# Altium schematic sheet Alt_BRD_PowerModules.SchDoc (part 1 of 2)
size A1; SheetNumber: 1; SheetTotal: 1
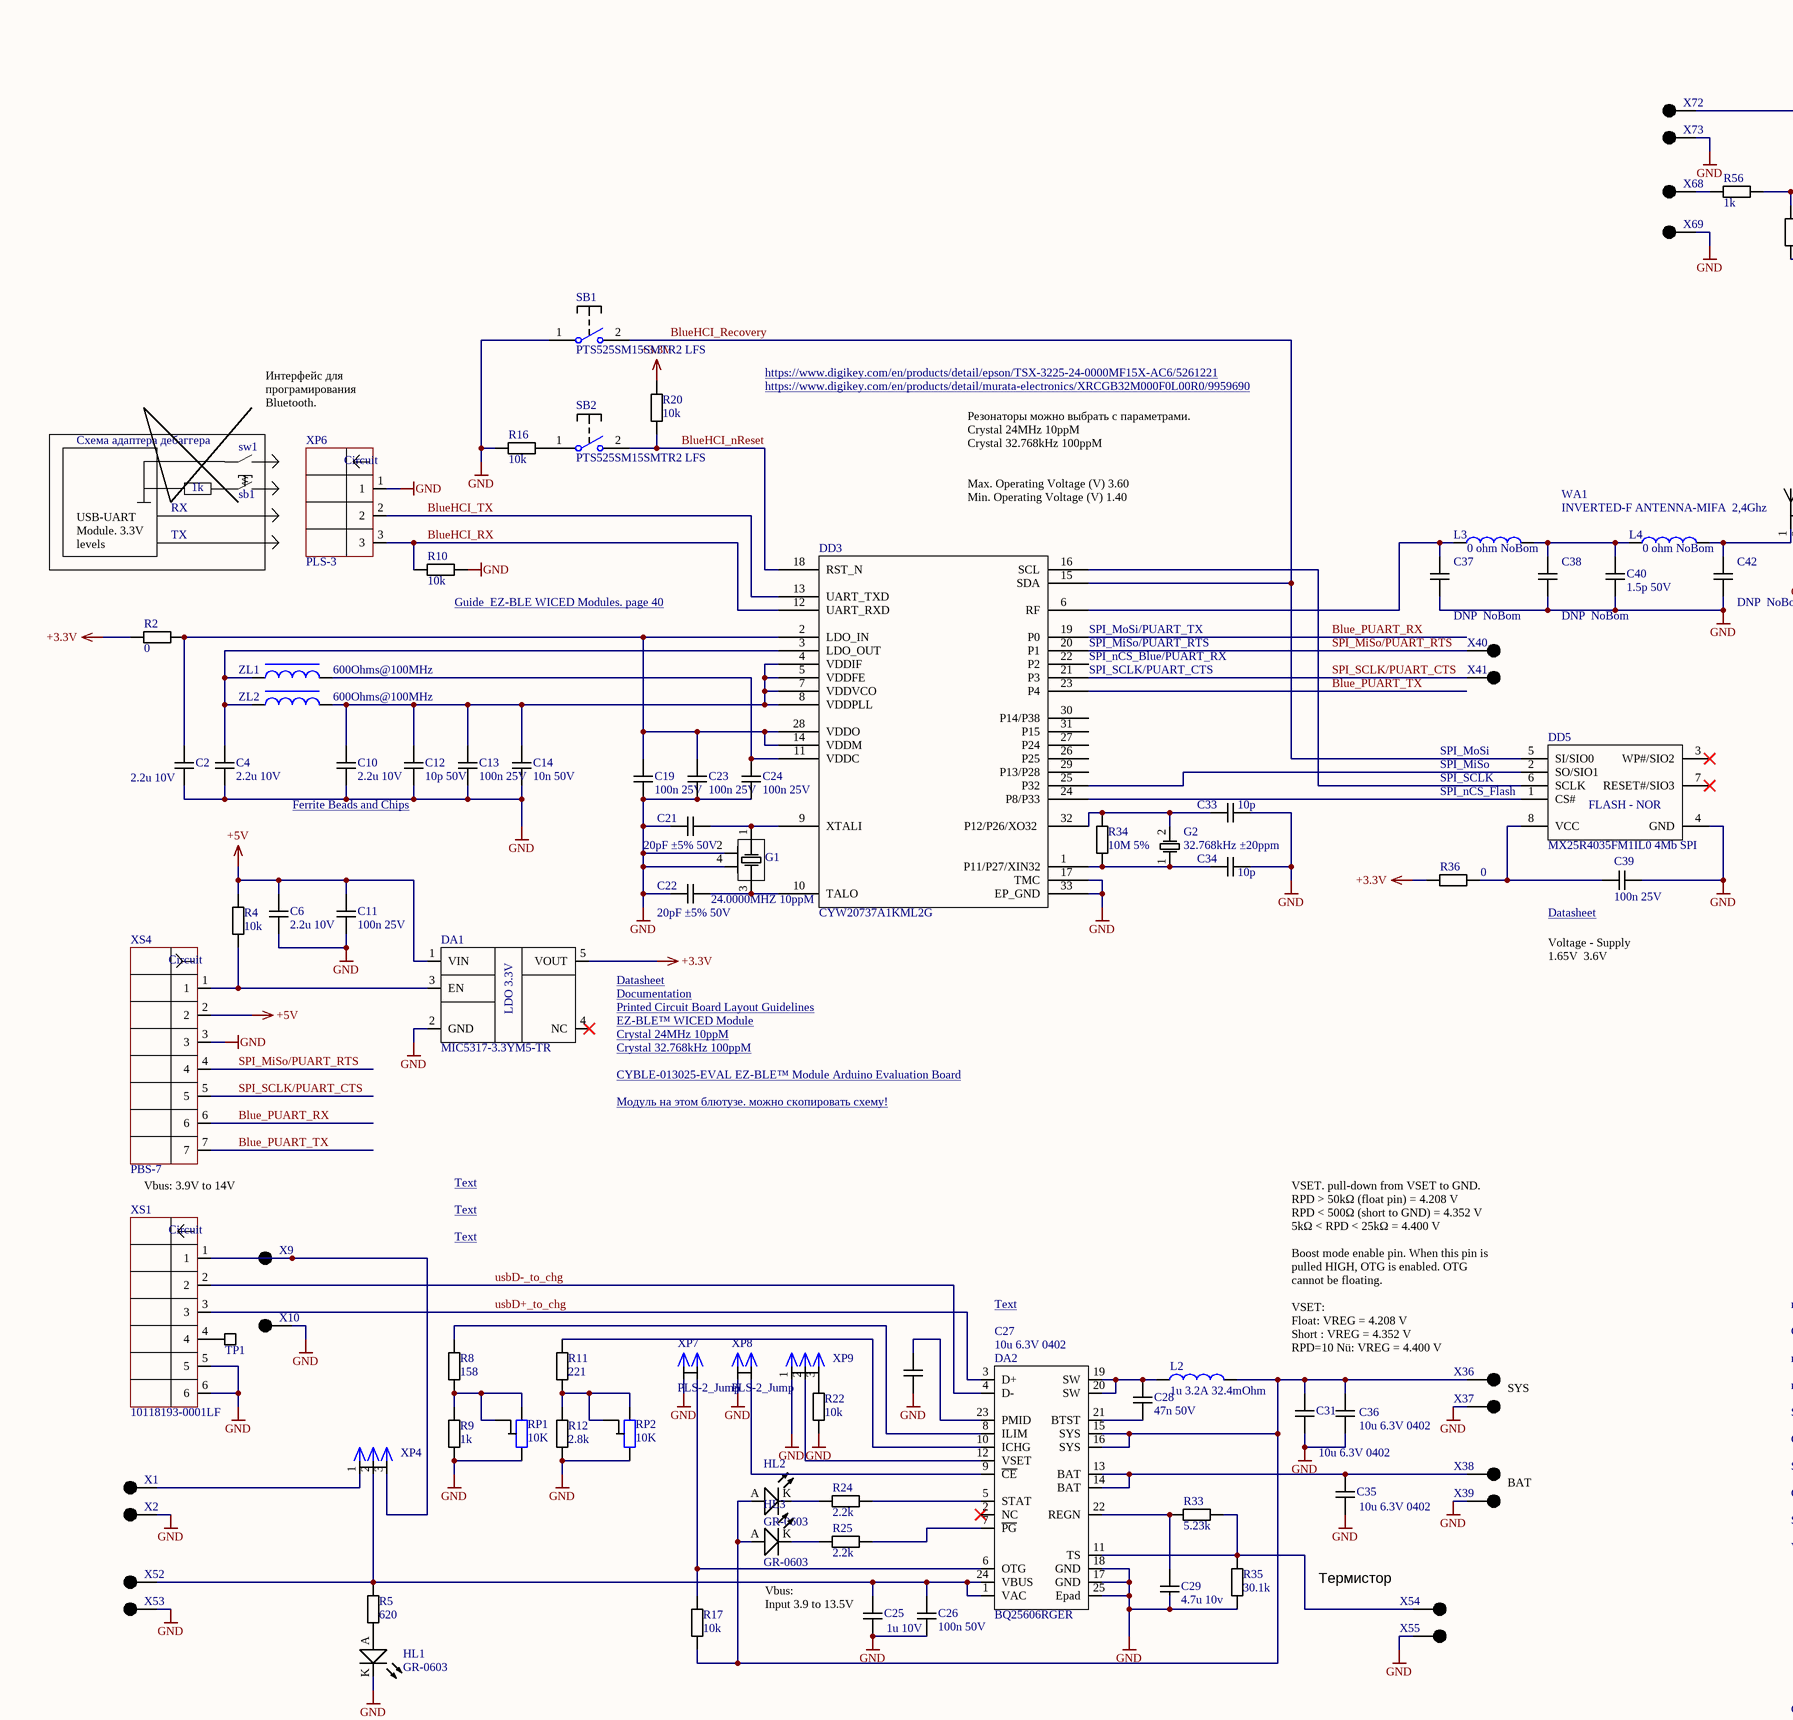
[diagram p0: Alt_BRD_PowerModules.SchDoc, top left]
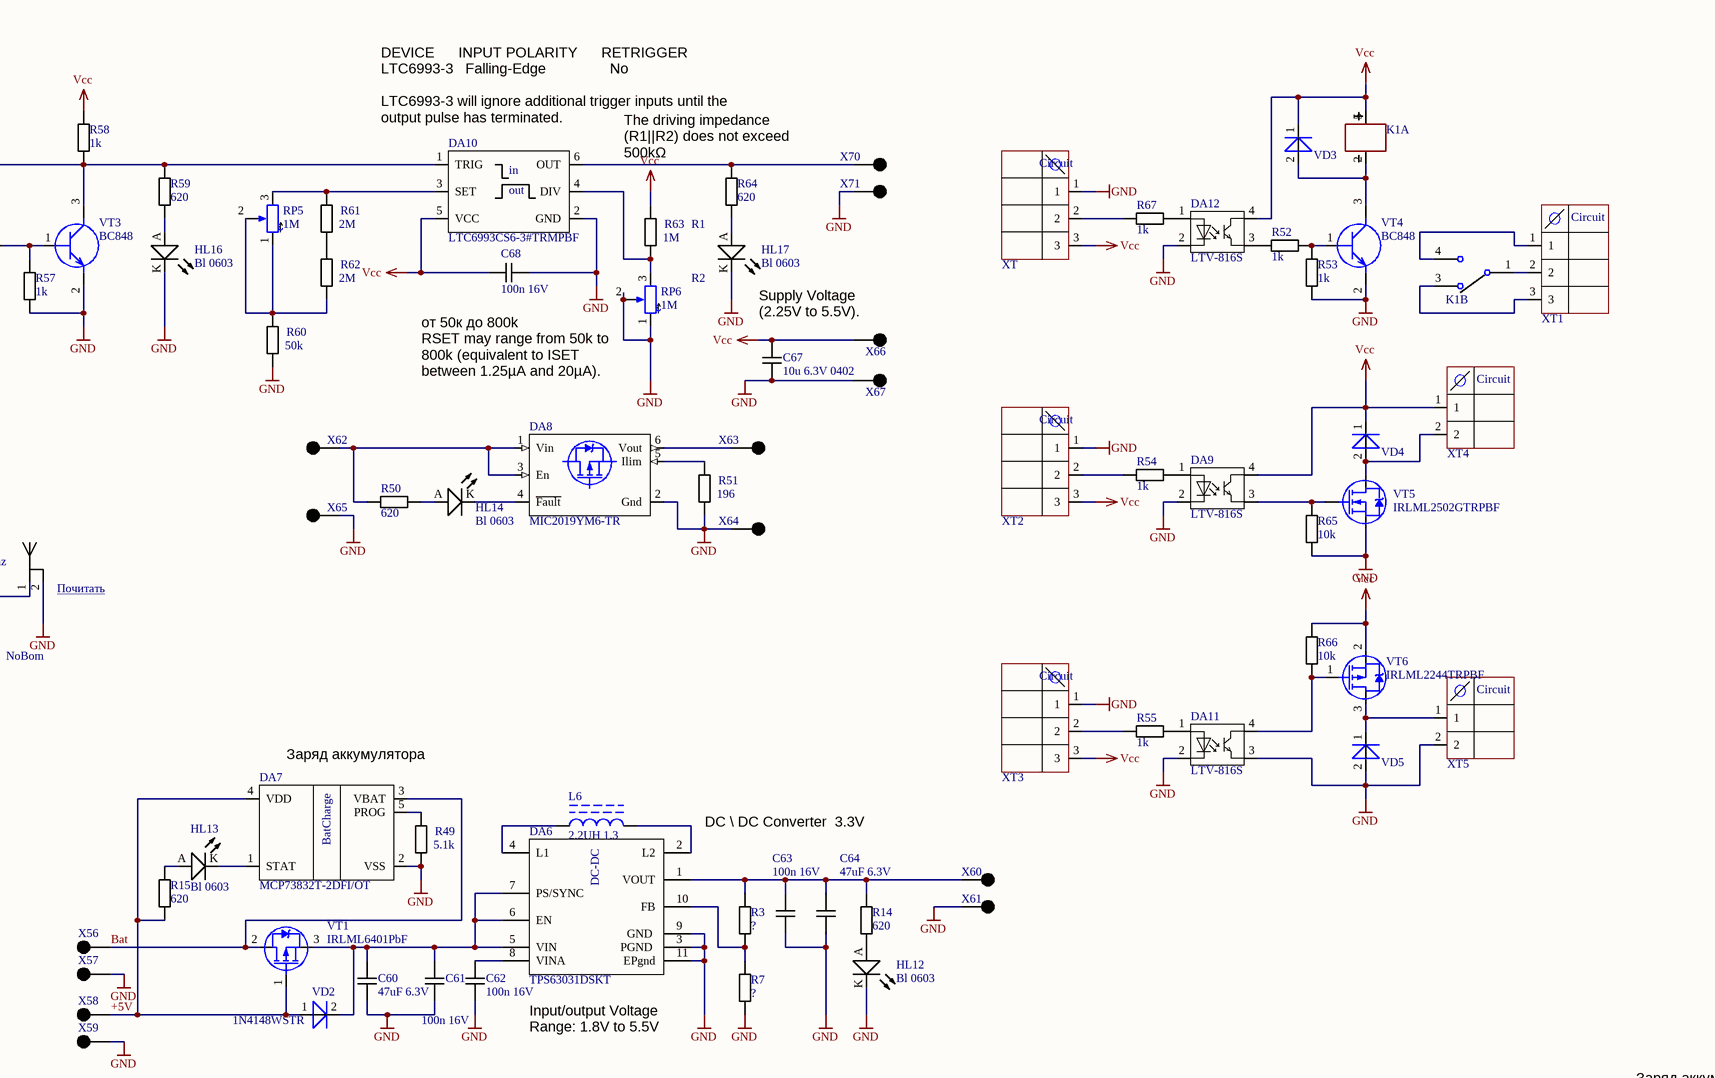
[diagram p1: Alt_BRD_PowerModules.SchDoc, top right]
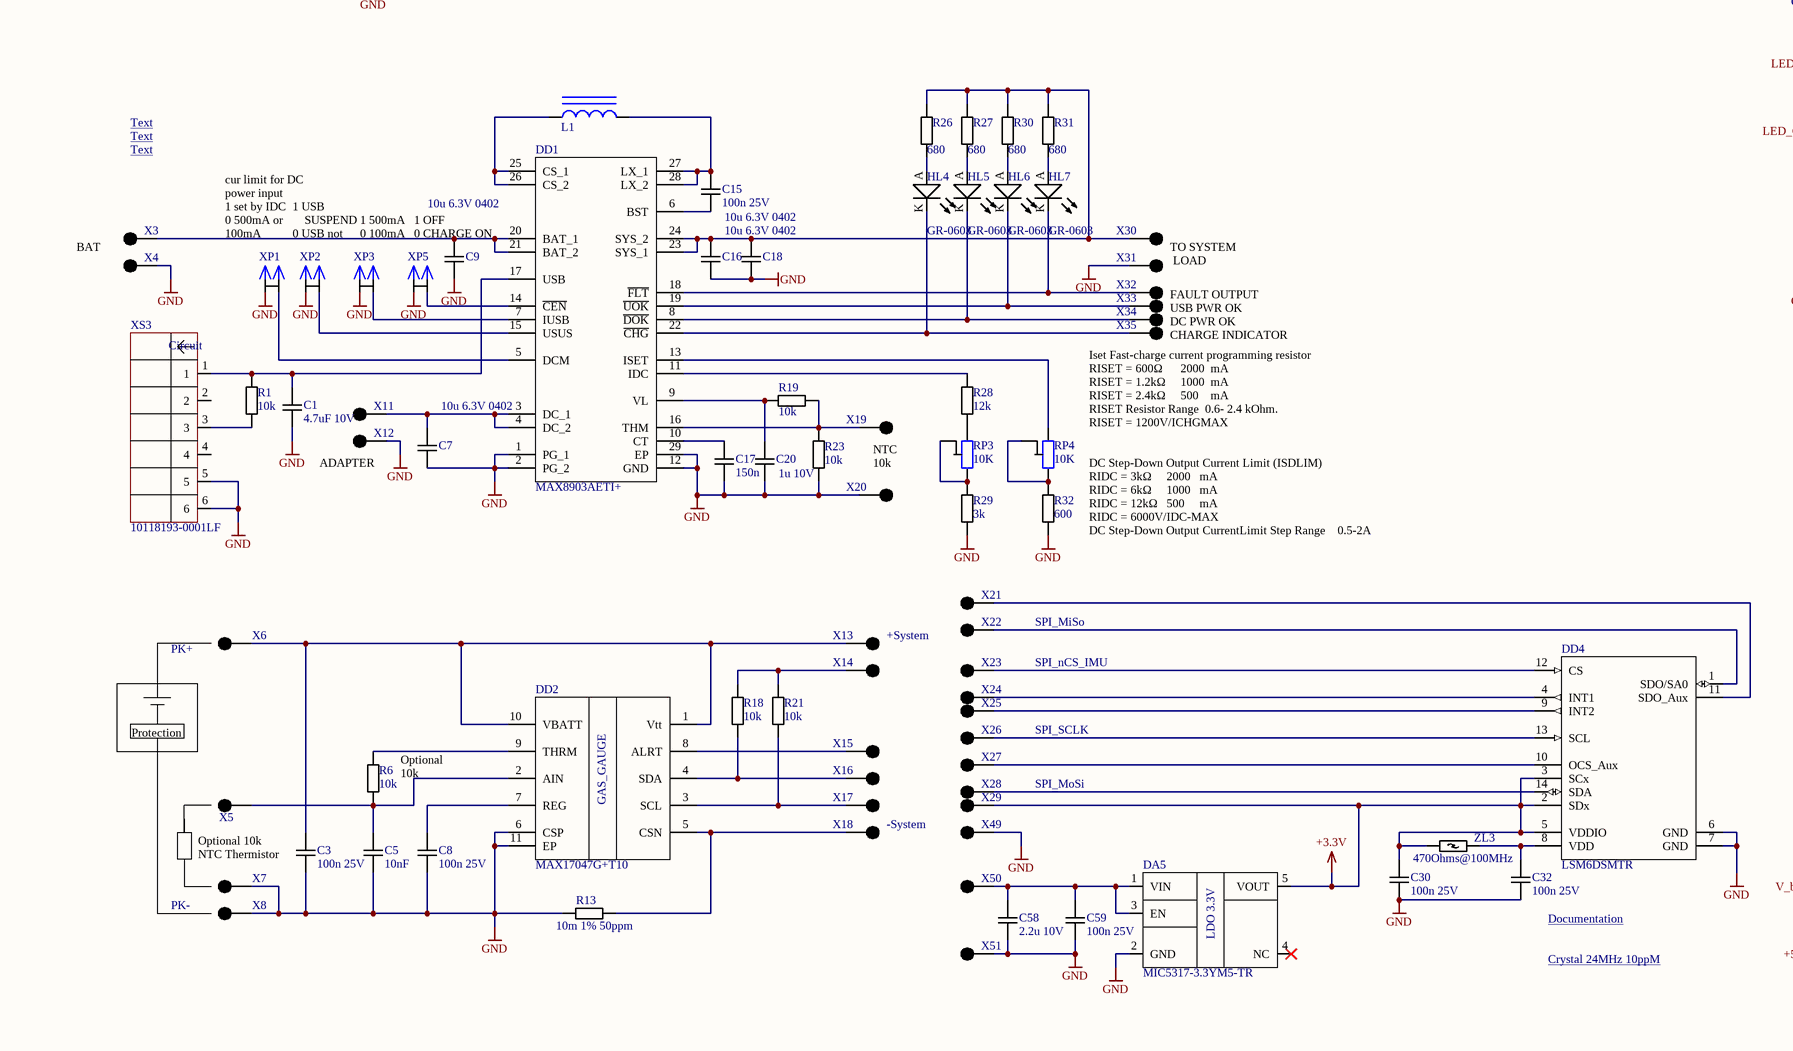
[diagram p2: Alt_BRD_PowerModules.SchDoc, bottom left]
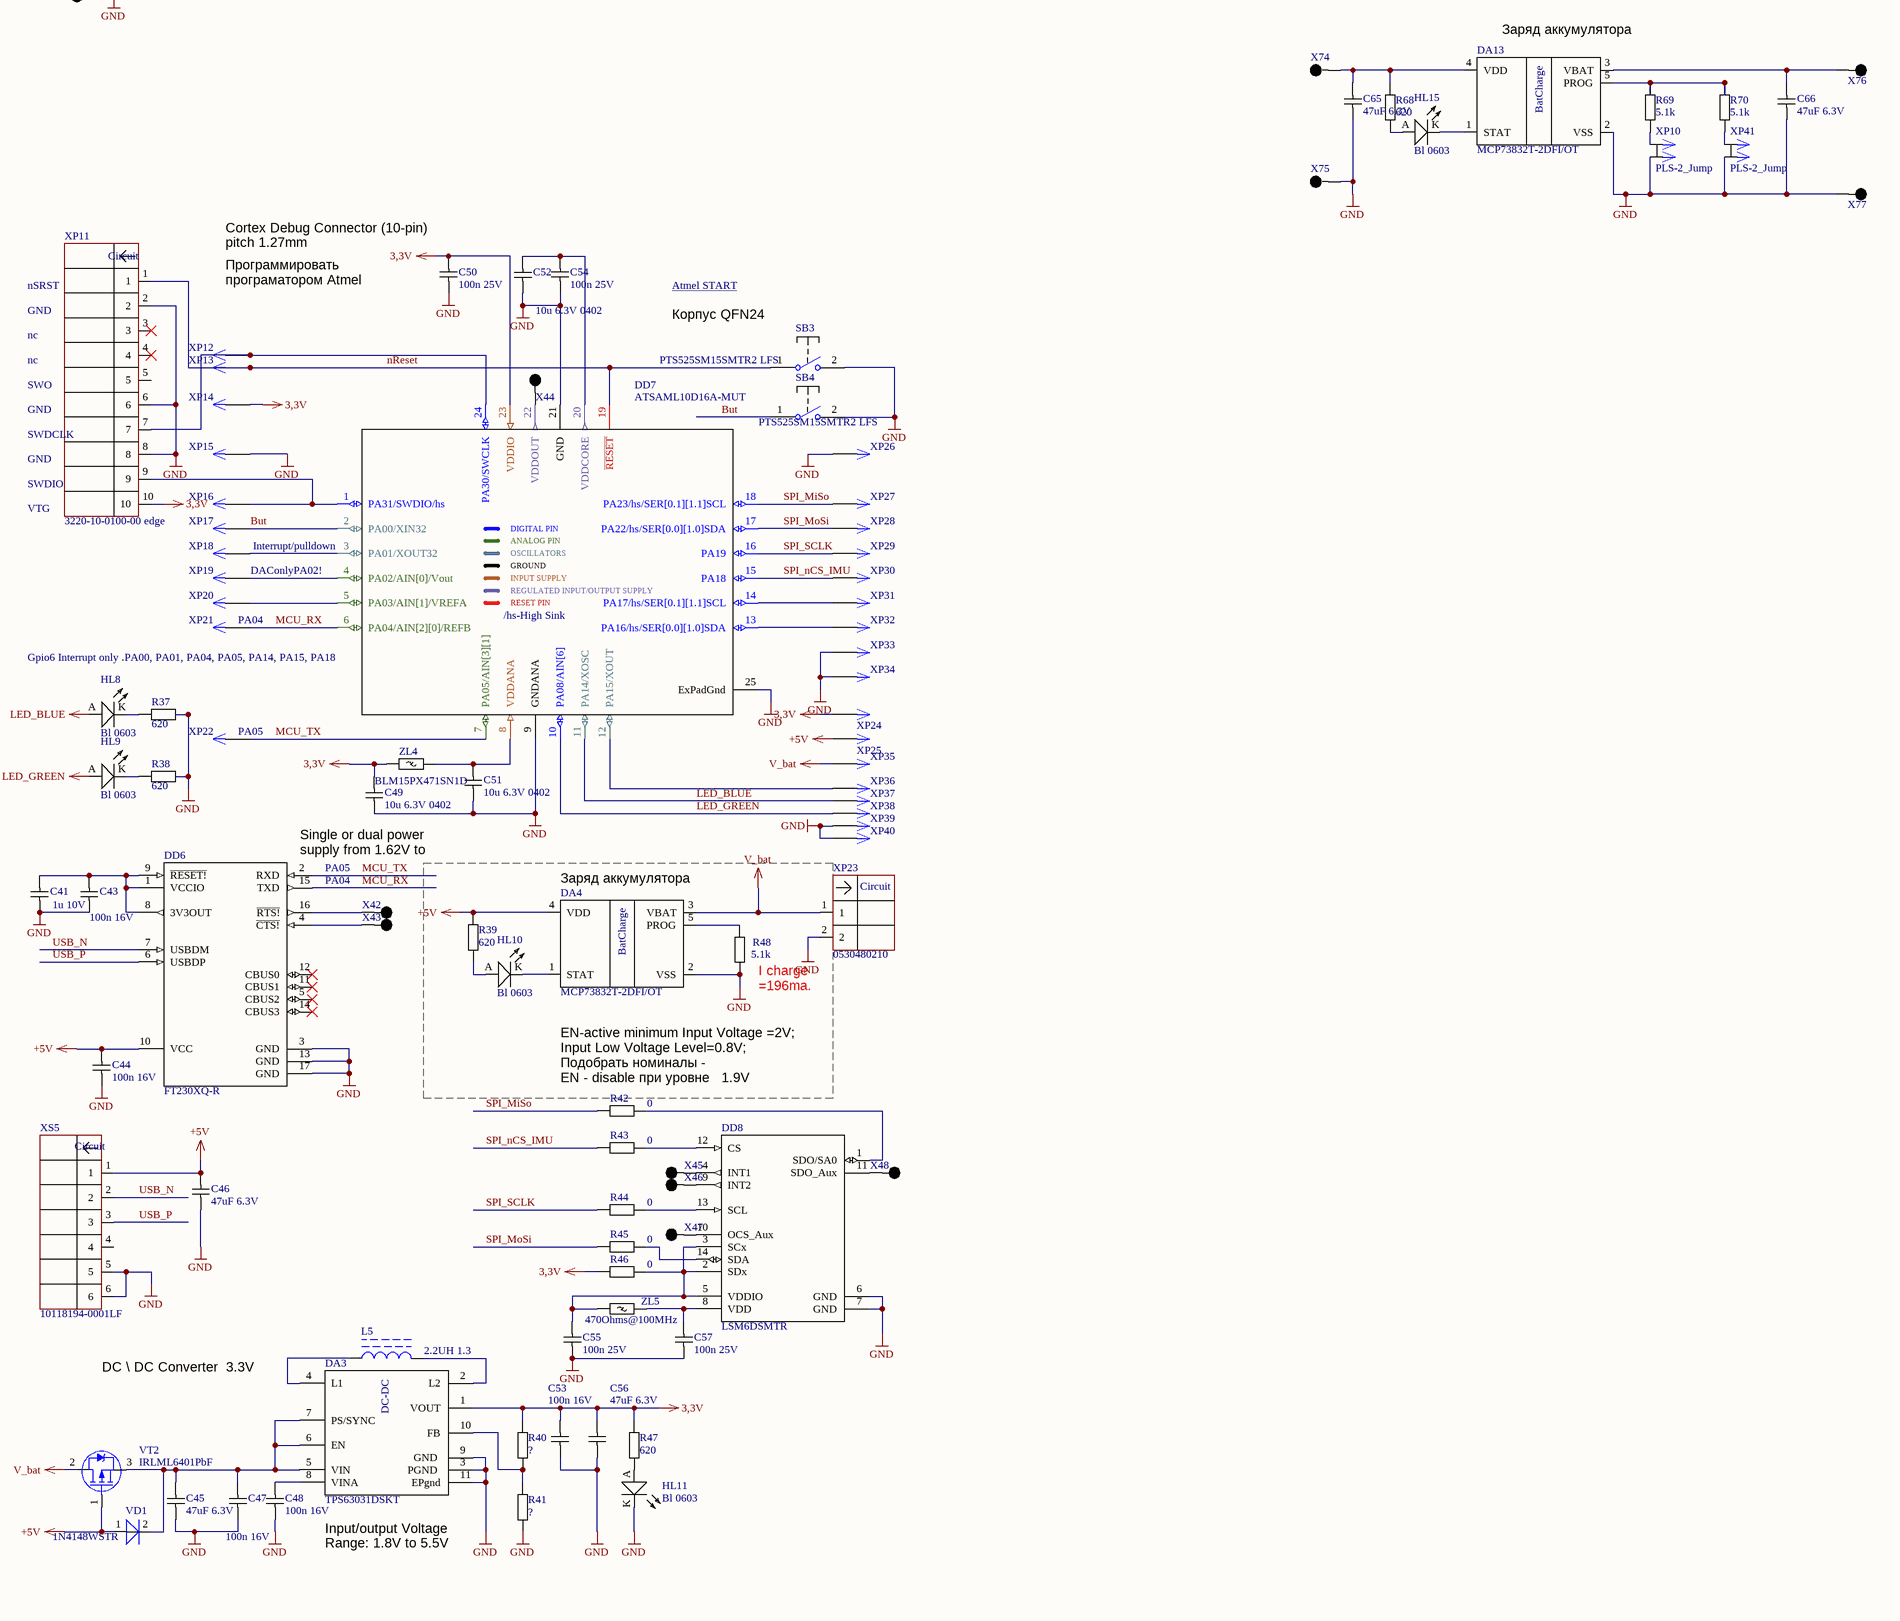
[diagram p3: Alt_BRD_PowerModules.SchDoc, bottom right]

## Parts
C1  4.7uF 10V  [CapKemet1005(0402)]
C2  2.2u 10V  [CapKemet1005(0402)]
C3  100n 25V  [CapKemet1005(0402)]
C4  2.2u 10V  [CapKemet1005(0402)]
C5  10nF  [CapKemet1005(0402)]
C6  2.2u 10V  [CapKemet1005(0402)]
C7  10u 6.3V 0402  [CapKemet1005(0402)]
C8  100n 25V  [CapKemet1005(0402)]
C9  10u 6.3V 0402  [CapKemet1005(0402)]
C10  2.2u 10V  [CapKemet1005(0402)]
C11  100n 25V  [CapKemet1005(0402)]
C12  10p 50V  [CapKemet1005(0402)]
C13  100n 25V  [CapKemet1005(0402)]
C14  10n 50V  [CapKemet1005(0402)]
C15  100n 25V  [CapKemet1005(0402)]
C16  10u 6.3V 0402  [CapKemet1005(0402)]
C17  150n  [CapKemet1005(0402)]
C18  10u 6.3V 0402  [CapKemet1005(0402)]
C19  100n 25V  [CapKemet1005(0402)]
C20  1u 10V  [CapKemet1005(0402)]
C21  20pF ±5% 50V  [CapKemet1005(0402)]
C22  20pF ±5% 50V  [CapKemet1005(0402)]
C23  100n 25V  [CapKemet1005(0402)]
C24  100n 25V  [CapKemet1005(0402)]
C25  1u 10V  [CapKemet1005(0402)]
C26  100n 50V  [CapKemet1005(0402)]
C27  10u 6.3V 0402  [CapKemet1005(0402)]
C28  47n 50V  [CapKemet1005(0402)]
C29  4.7u 10v  [CapKemet1005(0402)]
C30  100n 25V  [CapKemet1005(0402)]
C31  10u 6.3V 0402  [CapKemet1005(0402)]
C32  100n 25V  [CapKemet1005(0402)]
C33  10p  [CapKemet1005(0402)]
C34  10p  [CapKemet1005(0402)]
C35  10u 6.3V 0402  [CapKemet1005(0402)]
C36  10u 6.3V 0402  [CapKemet1005(0402)]
C37  DNP  NoBom  [CapKemet1005(0402)]  (no BOM)
C38  DNP  NoBom  [CapKemet1005(0402)]  (no BOM)
C39  100n 25V  [CapKemet1005(0402)]
C40  1.5p 50V  [CapKemet1005(0402)]
C41  1u 10V  [CapKemet1005(0402)]
C42  DNP  NoBom  [CapKemet1005(0402)]  (no BOM)
C43  100n 16V  [CapKemet1005(0402)]
C44  100n 16V  [CapKemet1005(0402)]
C45  47uF 6.3V  [CapKemet1005(0402)]
C46  47uF 6.3V  [CapKemet1005(0402)]
C47  100n 16V  [CapKemet1005(0402)]
C48  100n 16V  [CapKemet1005(0402)]
C49  10u 6.3V 0402  [CapKemet1005(0402)]
C50  100n 25V  [CapKemet1005(0402)]
C51  10u 6.3V 0402  [CapKemet1005(0402)]
C52  10u 6.3V 0402  [CapKemet1005(0402)]
C53  100n 16V  [CapKemet1005(0402)]
C54  100n 25V  [CapKemet1005(0402)]
C55  100n 25V  [CapKemet1005(0402)]
C56  47uF 6.3V  [CapKemet1005(0402)]
C57  100n 25V  [CapKemet1005(0402)]
C58  2.2u 10V  [CapKemet1005(0402)]
C59  100n 25V  [CapKemet1005(0402)]
C60  47uF 6.3V  [CapKemet1005(0402)]
C61  100n 16V  [CapKemet1005(0402)]
C62  100n 16V  [CapKemet1005(0402)]
C63  100n 16V  [CapKemet1005(0402)]
C64  47uF 6.3V  [CapKemet1005(0402)]
C65  47uF 6.3V  [CapKemet1005(0402)]
C66  47uF 6.3V  [CapKemet1005(0402)]
C67  10u 6.3V 0402  [CapKemet1005(0402)]
C68  100n 16V  [CapKemet1005(0402)]
DA1  MIC5317-3.3YM5-TR  [SOT-23-OT5_N]
DA2  BQ25606RGER  [VQFN-24]
DA3  TPS63031DSKT  [WSON-10]
DA4  MCP73832T-2DFI/OT  [SOT-23-5]
DA5  MIC5317-3.3YM5-TR  [SOT-23-OT5_N]
DA6  TPS63031DSKT  [WSON-10]
DA7  MCP73832T-2DFI/OT  [SOT-23-5]
DA8  MIC2019YM6-TR  [SOT23-6]
DA9  LTV-816S  [LTV-816S]
DA10  LTC6993CS6-3#TRMPBF  [SOT23-6]
DA11  LTV-816S  [LTV-816S]
DA12  LTV-816S  [LTV-816S]
DA13  MCP73832T-2DFI/OT  [SOT-23-5]
DD1  MAX8903AETI+  [QFN40P400X400X80-29N]
DD2  MAX17047G+T10  [DFN10(3x3)_N]
DD3  CYW20737A1KML2G  [QFN5X5-32_N]
DD4  LSM6DSMTR  [LGA-14L_2P5X3X0P83_STM-M]
DD5  MX25R4035FM1IL0 4Mb SPI  [MCHP-SOIC-SN8_M]
DD6  FT230XQ-R  [QFN-16(4x4)]
DD7  ATSAML10D16A-MUT  [VQFN-24]
DD8  LSM6DSMTR  [LGA-14L_2P5X3X0P83_STM-M]
G1  24.0000MHZ 10ppM  [TSX-3225]
G2  32.768kHz ±20ppm  [VMK3-9005]
HL1  GR-0603  [LED-0603-GREEN]
HL2  GR-0603  [LED-0603-GREEN]
HL3  GR-0603  [LED-0603-GREEN]
HL4  GR-0603  [LED-0603-GREEN]
HL5  GR-0603  [LED-0603-GREEN]
HL6  GR-0603  [LED-0603-GREEN]
HL7  GR-0603  [LED-0603-GREEN]
HL8  Bl 0603  [LED-0603-BLUE]
HL9  Bl 0603  [LED-0603-BLUE]
HL10  Bl 0603  [LED-0603-BLUE]
HL11  Bl 0603  [LED-0603-BLUE]
HL12  Bl 0603  [LED-0603-BLUE]
HL13  Bl 0603  [LED-0603-BLUE]
HL14  Bl 0603  [LED-0603-BLUE]
HL15  Bl 0603  [LED-0603-BLUE]
HL16  Bl 0603  [LED-0603-BLUE]
HL17  Bl 0603  [LED-0603-BLUE]
K1  5V 3A 250VAC  [SRS-05VDC-SL]  (value not drawn)  (parts A,B of 2)
L1  2.5UH 5A 27 MOHM  [SDE0805A]  (value not drawn)
L2  1u 3.2A 32.4mOhm  [NRS4018]
L3  0 ohm NoBom  [INDC1608(0603)N]  (no BOM)
L4  0 ohm NoBom  [INDC1608(0603)N]  (no BOM)
L5  2.2UH 1.3  [CDRH2D11]
L6  2.2UH 1.3  [CDRH2D11]
R1  10k  [REZKemet 0402]
R2  0  [REZKemet 0402]
R3  ?  [REZKemet 0402]
R4  10k  [REZKemet 0402]
R5  620  [REZKemet 0402]
R6  10k  [REZKemet 0402]
R7  ?  [REZKemet 0402]
R8  158  [REZKemet 0402]
R9  1k  [REZKemet 0402]
R10  10k  [REZKemet 0402]
R11  221  [REZKemet 0402]
R12  2.8k  [REZKemet 0402]
R13  10m 1% 50ppm  [RESC2012(0805)N]
R14  620  [REZKemet 0402]
R15  620  [REZKemet 0402]
R16  10k  [REZKemet 0402]
R17  10k  [REZKemet 0402]
R18  10k  [REZKemet 0402]
R19  10k  [REZKemet 0402]
R20  10k  [REZKemet 0402]
R21  10k  [REZKemet 0402]
R22  10k  [REZKemet 0402]
R23  10k  [REZKemet 0402]
R24  2.2k  [REZKemet 0402]
R25  2.2k  [REZKemet 0402]
R26  680  [REZKemet 0402]
R27  680  [REZKemet 0402]
R28  12k  [REZKemet 0402]
R29  3k  [REZKemet 0402]
R30  680  [REZKemet 0402]
R31  680  [REZKemet 0402]
R32  600  [REZKemet 0402]
R33  5.23k  [REZKemet 0402]
R34  10M 5%  [REZKemet 0402]
R35  30.1k  [REZKemet 0402]
R36  0  [REZKemet 0402]
R37  620  [REZKemet 0402]
R38  620  [REZKemet 0402]
R39  620  [REZKemet 0402]
R40  ?  [REZKemet 0402]
R41  ?  [REZKemet 0402]
R42  0  [REZKemet 0402]
R43  0  [REZKemet 0402]
R44  0  [REZKemet 0402]
R45  0  [REZKemet 0402]
R46  0  [REZKemet 0402]
R47  620  [REZKemet 0402]
R48  5.1k  [REZKemet 0402]
R49  5.1k  [REZKemet 0402]
R50  620  [REZKemet 0402]
R51  196  [REZKemet 0402]
R52  1k  [RESC1608(0603)N]
R53  1k  [RESC1608(0603)N]
R54  1k  [RESC1608(0603)N]
R55  1k  [RESC1608(0603)N]
R56  1k  [REZKemet 0402]
R57  1k  [REZKemet 0402]
R58  1k  [REZKemet 0402]
R59  620  [REZKemet 0402]
R60  50k  [REZKemet 0402]
R61  2M  [REZKemet 0402]
R62  2M  [REZKemet 0402]
R63  1M  [REZKemet 0402]
R64  620  [REZKemet 0402]
R65  10k  [RESC1608(0603)N]
R66  10k  [RESC1608(0603)N]
R67  1k  [RESC1608(0603)N]
R68  620  [REZKemet 0402]
R69  5.1k  [REZKemet 0402]
R70  5.1k  [REZKemet 0402]
RP1  10K  [3296W_1]
RP2  10K  [3296W_1]
RP3  10K  [3296W_1]
RP4  10K  [3296W_1]
RP5  1M  [3296W]
RP6  1M  [3296W]
SB1  PTS525SM15SMTR2 LFS  [TACT_SWITCH KPT1187B]
SB2  PTS525SM15SMTR2 LFS  [TACT_SWITCH KPT1187B]
SB3  PTS525SM15SMTR2 LFS  [TACT_SWITCH KPT1187B]
SB4  PTS525SM15SMTR2 LFS  [TACT_SWITCH KPT1187B]
TP1  TP(No BOM)  [PLLS1.27-1-R]  (value not drawn)  (no BOM)
VD1  1N4148WSTR  [SOD323]
VD2  1N4148WSTR  [SOD323]
VD3  BAT54J  [SOD323]  (value not drawn)
VD4  BAT54J  [SOD323]  (value not drawn)
VD5  BAT54J  [SOD323]  (value not drawn)
VT1  IRLML6401PbF  [SOT23-3N]
VT2  IRLML6401PbF  [SOT23-3N]
VT3  BC848  [SOT23-3N]
VT4  BC848  [SOT23-3N]
VT5  IRLML2502GTRPBF  [SOT23-3N]
VT6  IRLML2244TRPBF  [SOT23-3N]
WA1  INVERTED-F ANTENNA-MIFA  2,4Ghz  [INVERTED-F ANTENNA-MIFA]  (net tie, no BOM)
X1  X1-PLS-1  [HoleSolderPLS-1]  (value not drawn)
X2  X1-PLS-1  [HoleSolderPLS-1]  (value not drawn)
X3  X1-PLS-1  [HoleSolderPLS-1]  (value not drawn)
X4  X1-PLS-1  [HoleSolderPLS-1]  (value not drawn)
X5  X1-PLS-1  [HoleSolderPLS-1]  (value not drawn)
X6  X1-PLS-1  [HoleSolderPLS-1]  (value not drawn)
X7  X1-PLS-1  [HoleSolderPLS-1]  (value not drawn)
X8  X1-PLS-1  [HoleSolderPLS-1]  (value not drawn)
X9  X1-PLS-1  [HoleSolderPLS-1]  (value not drawn)
X10  X1-PLS-1  [HoleSolderPLS-1]  (value not drawn)
X11  X1-PLS-1  [HoleSolderPLS-1]  (value not drawn)
X12  X1-PLS-1  [HoleSolderPLS-1]  (value not drawn)
X13  X1-PLS-1  [HoleSolderPLS-1]  (value not drawn)
X14  X1-PLS-1  [HoleSolderPLS-1]  (value not drawn)
X15  X1-PLS-1  [HoleSolderPLS-1]  (value not drawn)
X16  X1-PLS-1  [HoleSolderPLS-1]  (value not drawn)
X17  X1-PLS-1  [HoleSolderPLS-1]  (value not drawn)
X18  X1-PLS-1  [HoleSolderPLS-1]  (value not drawn)
X19  X1-PLS-1  [HoleSolderPLS-1]  (value not drawn)
X20  X1-PLS-1  [HoleSolderPLS-1]  (value not drawn)
X21  PLLS1.27-1-R  [PLLS1.27-1-R]  (value not drawn)
X22  PLLS1.27-1-R  [PLLS1.27-1-R]  (value not drawn)
X23  PLLS1.27-1-R  [PLLS1.27-1-R]  (value not drawn)
X24  PLLS1.27-1-R  [PLLS1.27-1-R]  (value not drawn)
X25  PLLS1.27-1-R  [PLLS1.27-1-R]  (value not drawn)
X26  PLLS1.27-1-R  [PLLS1.27-1-R]  (value not drawn)
X27  PLLS1.27-1-R  [PLLS1.27-1-R]  (value not drawn)
X28  PLLS1.27-1-R  [PLLS1.27-1-R]  (value not drawn)
X29  PLLS1.27-1-R  [PLLS1.27-1-R]  (value not drawn)
X30  X1-PLS-1  [HoleSolderPLS-1]  (value not drawn)
X31  X1-PLS-1  [HoleSolderPLS-1]  (value not drawn)
X32  X1-PLS-1  [HoleSolderPLS-1]  (value not drawn)
X33  X1-PLS-1  [HoleSolderPLS-1]  (value not drawn)
X34  X1-PLS-1  [HoleSolderPLS-1]  (value not drawn)
X35  X1-PLS-1  [HoleSolderPLS-1]  (value not drawn)
X36  X1-PLS-1  [HoleSolderPLS-1]  (value not drawn)
X37  X1-PLS-1  [HoleSolderPLS-1]  (value not drawn)
X38  X1-PLS-1  [HoleSolderPLS-1]  (value not drawn)
X39  X1-PLS-1  [HoleSolderPLS-1]  (value not drawn)
X40  PLLS1.27-1-TOP-R  [PLLS1.27-1-TOP-R]  (value not drawn)
X41  PLLS1.27-1-TOP-R  [PLLS1.27-1-TOP-R]  (value not drawn)
X42  PLLS1.27-1-TOP-R  [PLLS1.27-1-TOP-R]  (value not drawn)
X43  PLLS1.27-1-TOP-R  [PLLS1.27-1-TOP-R]  (value not drawn)
X44  PLLS1.27-1-TOP-R  [PLLS1.27-1-TOP-R]  (value not drawn)
X45  PLLS1.27-1-TOP-R  [PLLS1.27-1-TOP-R]  (value not drawn)
X46  PLLS1.27-1-TOP-R  [PLLS1.27-1-TOP-R]  (value not drawn)
X47  PLLS1.27-1-TOP-R  [PLLS1.27-1-TOP-R]  (value not drawn)
X48  PLLS1.27-1-TOP-R  [PLLS1.27-1-TOP-R]  (value not drawn)
X49  PLLS1.27-1-R  [PLLS1.27-1-R]  (value not drawn)
X50  PLLS1.27-1-R  [PLLS1.27-1-R]  (value not drawn)
X51  PLLS1.27-1-R  [PLLS1.27-1-R]  (value not drawn)
X52  X1-PLS-1  [HoleSolderPLS-1]  (value not drawn)
X53  X1-PLS-1  [HoleSolderPLS-1]  (value not drawn)
X54  X1-PLS-1  [HoleSolderPLS-1]  (value not drawn)
X55  X1-PLS-1  [HoleSolderPLS-1]  (value not drawn)
X56  PLLS1.27-1-R  [PLLS1.27-1-R]  (value not drawn)
X57  PLLS1.27-1-R  [PLLS1.27-1-R]  (value not drawn)
X58  PLLS1.27-1-R  [PLLS1.27-1-R]  (value not drawn)
X59  PLLS1.27-1-R  [PLLS1.27-1-R]  (value not drawn)
X60  PLLS1.27-1-R  [PLLS1.27-1-R]  (value not drawn)
X61  PLLS1.27-1-R  [PLLS1.27-1-R]  (value not drawn)
X62  X1-PLS-1  [HoleSolderPLS-1]  (value not drawn)
X63  X1-PLS-1  [HoleSolderPLS-1]  (value not drawn)
X64  X1-PLS-1  [HoleSolderPLS-1]  (value not drawn)
X65  X1-PLS-1  [HoleSolderPLS-1]  (value not drawn)
X66  X1-PLS-1  [HoleSolderPLS-1]  (value not drawn)
X67  X1-PLS-1  [HoleSolderPLS-1]  (value not drawn)
X68  X1-PLS-1  [HoleSolderPLS-1]  (value not drawn)
X69  X1-PLS-1  [HoleSolderPLS-1]  (value not drawn)
X70  X1-PLS-1  [HoleSolderPLS-1]  (value not drawn)
X71  X1-PLS-1  [HoleSolderPLS-1]  (value not drawn)
X72  X1-PLS-1  [HoleSolderPLS-1]  (value not drawn)
X73  X1-PLS-1  [HoleSolderPLS-1]  (value not drawn)
X74  PLLS1.27-1-R  [PLLS1.27-1-R]  (value not drawn)
X75  PLLS1.27-1-R  [PLLS1.27-1-R]  (value not drawn)
X76  PLLS1.27-1-R  [PLLS1.27-1-R]  (value not drawn)
X77  PLLS1.27-1-R  [PLLS1.27-1-R]  (value not drawn)
XP1  PLS-2_Jump  [PLS-2-3D]  (value not drawn)
XP2  PLS-2_Jump  [PLS-2-3D]  (value not drawn)
XP3  PLS-2_Jump  [PLS-2-3D]  (value not drawn)
XP4  PLS-3  [PLS-3-3D]  (value not drawn)
XP5  PLS-2_Jump  [PLS-2-3D]  (value not drawn)
XP6  PLS-3  [PLS-3-3D]
XP7  PLS-2_Jump  [PLS-2-3D]
XP8  PLS-2_Jump  [PLS-2-3D]
XP9  PLS-3  [PLS-3-3D]  (value not drawn)
XP10  PLS-2_Jump  [PLS-2-3D]
XP11  3220-10-0100-00 edge  [IPS 10(1.27)edge]
XP12  PLS-1  [PLS-1-3D]  (value not drawn)
XP13  PLS-1  [PLS-1-3D]  (value not drawn)
XP14  PLS-1  [PLS-1-3D]  (value not drawn)
XP15  PLS-1  [PLS-1-3D]  (value not drawn)
XP16  PLS-1  [PLS-1-3D]  (value not drawn)
XP17  PLS-1  [PLS-1-3D]  (value not drawn)
XP18  PLS-1  [PLS-1-3D]  (value not drawn)
XP19  PLS-1  [PLS-1-3D]  (value not drawn)
XP20  PLS-1  [PLS-1-3D]  (value not drawn)
XP21  PLS-1  [PLS-1-3D]  (value not drawn)
XP22  PLS-1  [PLS-1-3D]  (value not drawn)
XP23  0530480210  [0530480210]
XP24  PLS-1  [PLS-1-3D]  (value not drawn)
XP25  PLS-1  [PLS-1-3D]  (value not drawn)
XP26  PLS-1  [PLS-1-3D]  (value not drawn)
XP27  PLS-1  [PLS-1-3D]  (value not drawn)
XP28  PLS-1  [PLS-1-3D]  (value not drawn)
XP29  PLS-1  [PLS-1-3D]  (value not drawn)
XP30  PLS-1  [PLS-1-3D]  (value not drawn)
XP31  PLS-1  [PLS-1-3D]  (value not drawn)
XP32  PLS-1  [PLS-1-3D]  (value not drawn)
XP33  PLS-1  [PLS-1-3D]  (value not drawn)
XP34  PLS-1  [PLS-1-3D]  (value not drawn)
XP35  PLS-1  [PLS-1-3D]  (value not drawn)
XP36  PLS-1  [PLS-1-3D]  (value not drawn)
XP37  PLS-1  [PLS-1-3D]  (value not drawn)
XP38  PLS-1  [PLS-1-3D]  (value not drawn)
XP39  PLS-1  [PLS-1-3D]  (value not drawn)
XP40  PLS-1  [PLS-1-3D]  (value not drawn)
XP41  PLS-2_Jump  [PLS-2-3D]
XS1  10118193-0001LF  [10118193-0001LF]
XS3  10118193-0001LF  [10118193-0001LF]
XS4  PBS-7  [PBS-7-3D]
XS5  10118194-0001LF  [MICRO_USB _B]
XT  3pin 3,5mm  [1984620]  (value not drawn)
XT1  3pin 3,5mm  [1984620]  (value not drawn)
XT2  3pin 3,5mm  [1984620]  (value not drawn)
XT3  3pin 3,5mm  [1984620]  (value not drawn)
XT4  2pos5mm  [691137710002]  (value not drawn)
XT5  2pos5mm  [691137710002]  (value not drawn)
ZL1  600Ohms@100MHz  [Ferrite1005(0402)]
ZL2  600Ohms@100MHz  [Ferrite1005(0402)]
ZL3  470Ohms@100MHz  [Ferrite1005(0402)]
ZL4  BLM15PX471SN1D  [Ferrite1005(0402)]
ZL5  470Ohms@100MHz  [Ferrite1005(0402)]

## Nets
3,3V: C49.2 C50.1 C53.2 C56.2 DA3.1(VOUT) DD7.23(VDDIO) R40.2 R46.1 R47.2 XP11.10 XP14.1 XP24.1 ZL4.1
+3.3V: C30.1 DA1.5(VOUT) DA5.5(VOUT) DD4.2(SDx) DD4.3(SCx) DD4.5(VDDIO) R2.2 R20.2 R36.1 X29.1 ZL3.1
+5V: C6.2 C11.2 C44.2 C46.2 DA1.1(VIN) DA4.4(VDD) DA7.4(VDD) DD6.10(VCC) R4.2 R15.2 R39.2 VD1.1 VD2.1 VT1.1(G) VT2.1(G) X58.1 XP25.1 XS4.2 XS5.1
GND: C1.1 C2.1 C3.1 C4.1 C5.1 C6.1 C7.1 C8.1 C9.1 C10.1 C11.1 C12.1 C13.1 C14.1 C16.1 C17.1 C18.1 C19.1 C20.1 C21.1 C22.1 C23.1 C24.1 C25.1 C26.2 C27.1 C29.1 C30.2 C31.1 C32.2 C33.1 C34.1 C35.1 C36.1 C37.1 C38.1 C39.1 C40.1 C41.1 C42.1 C43.1 C44.1 C45.1 C46.1 C47.1 C48.1 C49.1 C50.2 C51.1 C52.1 C53.1 C54.2 C55.2 C56.1 C57.2 C58.1 C59.1 C60.1 C61.1 C62.1 C63.1 C64.1 C65.1 C66.1 C67.1 C68.1 DA1.2(GND) DA2.17(GND) DA2.18(GND) DA2.25(Epad) DA3.3(PGND) DA3.9(GND) DA3.11(EPgnd) DA4.2(VSS) DA5.2(GND) DA6.3(PGND) DA6.9(GND) DA6.11(EPgnd) DA7.2(VSS) DA8.2(Gnd) DA9.2 DA10.2(GND) DA11.2 DA11.3 DA12.2 DA13.2(VSS) DD1.1(PG_1) DD1.2(PG_2) DD1.12(GND) DD1.29(EP) DD2.6(CSP) DD2.11(EP) DD3.17(TMC) DD3.33(EP_GND) DD4.6(GND) DD4.7(GND) DD5.4(GND) DD6.3(GND) DD6.13(GND) DD6.17(GND) DD7.9(GNDANA) DD7.21(GND) DD7.25(ExPadGnd) DD8.6(GND) DD8.7(GND) G1.2 G1.4 HL1.K HL11.K HL12.K HL16.K HL17.K R7.1 R9.1 R10.1 R12.1 R13.1 R16.2 R22.2 R23.2 R29.1 R32.1 R35.2 R37.2 R38.2 R41.1 R48.2 R49.2 R51.2 R53.1 R57.2 R60.2 R65.1 RP1.3(TAP) RP2.3(TAP) RP6.1(TOP) RP6.2(BOT) SB1.1(COMMON) SB3.2(NO) SB4.2(NO) VD5.2(A) VT3.2(E) VT4.2(E) VT5.2(S) WA1.2 X2.1 X4.1 X7.1 X8.1 X10.1 X12.1 X20.1 X31.1 X37.1 X39.1 X49.1 X51.1 X53.1 X55.1 X57.1 X59.1 X61.1 X64.1 X65.1 X67.1 X69.1 X71.1 X73.1 X75.1 X77.1 XP1.1 XP2.1 XP3.1 XP5.1 XP6.1 XP7.1 XP8.1 XP9.1 XP10.2 XP11.2 XP11.6 XP11.8 XP15.1 XP23.2 XP26.1 XP33.1 XP34.1 XP39.1 XP40.1 XP41.2 XS1.5 XS1.6 XS3.5 XS3.6 XS4.3 XS5.5 XS5.6 XT.1 XT2.1 XT3.1 XT5.2
LED_BLUE: DD7.11(PA14/XOSC) HL8.A XP37.1
LED_GREEN: DD7.10(PA08/AIN[6]) HL9.A XP38.1
V_bat: DA4.3(VBAT) VT2.2(D) XP23.1 XP35.1
Vcc: C67.2 C68.2 DA9.4 DA10.5(VCC) DA12.4 K1.5 R58.1 R63.1 R66.2 VD3.1(C) VD4.1(C) VT6.2(S) X66.1 XT.3 XT2.3 XT3.3 XT4.1
Bat: DA7.3(VBAT) VT1.2(D) X56.1
Blue_PUART_RX: DD3.19(P0) XS4.6
Blue_PUART_TX: DD3.23(P4) XS4.7
BlueHCI_nReset: DD3.18(RST_N) R20.1 SB2.2(NO)
BlueHCI_Recovery: DD3.15(SDA) DD5.5(SI/SIO0) SB1.2(NO)
BlueHCI_RX: DD3.12(UART_RXD) R10.2 XP6.3
BlueHCI_TX: DD3.13(UART_TXD) XP6.2
But: DD7.2(PA00/XIN32) SB4.1(COMMON) XP17.1
MCU_RX: DD6.15(TXD) DD7.6(PA04/AIN[2][0]/REFB) XP21.1
MCU_TX: DD6.2(RXD) DD7.7(PA05/AIN[3][1]) XP22.1
nReset: DD7.19(~{RESET}) SB3.1(COMMON) XP11.1 XP13.1
SPI_MiSo: DD7.18(PA23/hs/SER[0.1][1.1]SCL) R42.1 XP27.1
SPI_MiSo/PUART_RTS: DD3.20(P1) X40.1 XS4.4
SPI_MoSi: DD7.17(PA22/hs/SER[0.0][1.0]SDA) R45.1 XP28.1
SPI_nCS_IMU: DD7.15(PA18) R43.1 XP30.1
SPI_SCLK: DD7.16(PA19) R44.1 XP29.1
SPI_SCLK/PUART_CTS: DD3.21(P3) X41.1 XS4.5
USB_N: DD6.7(USBDM) XS5.2
USB_P: DD6.6(USBDP) XS5.3
usbD+_to_chg: DA2.3(D+) XS1.3
usbD-_to_chg: DA2.4(D-) XS1.2
NetC1_2: C1.2 DD1.17(USB) R1.1 XS3.1
NetC2_2: C2.2 C19.2 C23.2 DD3.2(LDO_IN) DD3.14(VDDM) DD3.28(VDDO) R2.1
NetC3_2: C3.2 DD2.1(Vtt) DD2.10(VBATT) X6.1 X13.1
NetC4_2: C4.2 DD3.3(LDO_OUT) ZL1.1 ZL2.1
NetC5_2: C5.2 DD2.2(AIN) R6.1 X5.1
NetC7_2: C7.2 DD1.3(DC_1) DD1.4(DC_2) X11.1
NetC8_2: C8.2 DD2.7(REG)
NetC9_2: C9.2 DD1.20(BAT_1) DD1.21(BAT_2) X3.1
NetC10_2: C10.2 C12.2 C13.2 C14.2 DD3.4(VDDIF) DD3.5(VDDFE) DD3.7(VDDVCO) DD3.8(VDDPLL) ZL2.2
NetC15_1: C15.1 DD1.6(BST)
NetC15_2: C15.2 DD1.27(LX_1) DD1.28(LX_2) L1.2
NetC16_2: C16.2 C18.2 DD1.23(SYS_1) DD1.24(SYS_2) R26.2 R27.2 R30.2 R31.2 X30.1
NetC17_2: C17.2 DD1.10(CT)
NetC20_2: C20.2 DD1.9(VL) R19.2
NetC21_2: C21.2 DD3.9(XTALI) G1.1
NetC22_2: C22.2 DD3.10(TALO) G1.3
NetC24_2: C24.2 DD3.11(VDDC) ZL1.2
NetC25_2: C25.2 C26.1 DA2.1(VAC) DA2.24(VBUS) R5.2 X52.1 XP4.2
NetC27_2: C27.2 DA2.23(PMID)
NetC28_1: C28.1 DA2.19(SW) DA2.20(SW) L2.1
NetC28_2: C28.2 DA2.21(BTST)
NetC29_2: C29.2 DA2.22(REGN) R33.1
NetC31_2: C31.2 C36.2 DA2.15(SYS) DA2.16(SYS) HL2.A HL3.A L2.2 R17.2 X36.1
NetC32_1: C32.1 DD4.8(VDD) ZL3.2
NetC33_2: C33.2 DD3.32(P12/P26/XO32) G2.2 R34.2
NetC34_2: C34.2 DD3.1(P11/P27/XIN32) G2.1 R34.1
NetC35_2: C35.2 DA2.13(BAT) DA2.14(BAT) X38.1
NetC37_2: C37.2 DD3.6(RF) L3.1
NetC38_2: C38.2 C40.2 L3.2 L4.1
NetC39_2: C39.2 DD5.8(VCC) R36.2
NetC41_2: C41.2 C43.2 DD6.1(VCCIO) DD6.8(3V3OUT) DD6.9(~{RESET!})
NetC42_2: C42.2 L4.2 WA1.1
NetC45_2: C45.2 C47.2 DA3.5(VIN) DA3.6(EN) DA3.7(PS/SYNC) VD1.2 VT2.3(S)
NetC48_2: C48.2 DA3.8(VINA)
NetC51_2: C51.2 DD7.8(VDDANA) ZL4.2
NetC52_2: C52.2 C54.1 DD7.20(VDDCORE)
NetC55_1: C55.1 DD8.2(SDx) DD8.3(SCx) DD8.5(VDDIO) R46.2 ZL5.1
NetC57_1: C57.1 DD8.8(VDD) ZL5.2
NetC58_2: C58.2 C59.2 DA5.1(VIN) DA5.3(EN) X50.1
NetC60_2: C60.2 C61.2 DA6.5(VIN) DA6.6(EN) DA6.7(PS/SYNC) VD2.2 VT1.3(S)
NetC62_2: C62.2 DA6.8(VINA)
NetC63_2: C63.2 C64.2 DA6.1(VOUT) R3.2 R14.2 X60.1
NetC65_2: C65.2 DA13.4(VDD) R68.2 X74.1
NetC66_2: C66.2 DA13.3(VBAT) X76.1
NetDA1_3: DA1.3(EN) R4.1 XS4.1
NetDA2_5: DA2.5(STAT) R24.1
NetDA2_6: DA2.6(OTG) R17.1 XP7.2
NetDA2_7: DA2.7(~{PG}) R25.1
NetDA2_8: DA2.8(ILIM) R8.2
NetDA2_9: DA2.9(~{CE}) XP8.2
NetDA2_10: DA2.10(ICHG) R11.2
NetDA2_11: DA2.11(TS) R33.2 R35.1 X54.1
NetDA2_12: DA2.12(VSET) XP9.2
NetDA3_2: DA3.2(L2) L5.2
NetDA3_4: DA3.4(L1) L5.1
NetDA3_10: DA3.10(FB) R40.1 R41.2
NetDA4_1: DA4.1(STAT) HL10.K
NetDA4_5: DA4.5(PROG) R48.1
NetDA6_2: DA6.2(L2) L6.1
NetDA6_4: DA6.4(L1) L6.2
NetDA6_10: DA6.10(FB) R3.1 R7.2
NetDA7_1: DA7.1(STAT) HL13.K
NetDA7_5: DA7.5(PROG) R49.1
NetDA8_1: DA8.1(Vin) DA8.3(En) R50.1 X62.1
NetDA8_4: DA8.4(~{Fault}) HL14.K
NetDA8_5: DA8.5(Ilim) R51.1
NetDA8_6: DA8.6(Vout) X63.1
NetDA9_1: DA9.1 R54.2
NetDA9_3: DA9.3 R65.2 VT5.1(G)
NetDA10_1: DA10.1(TRIG) R58.2 R59.1 VT3.3(C) X72.1
NetDA10_3: DA10.3(SET) R61.1 RP5.3(TAP)
NetDA10_4: DA10.4(DIV) R63.2 RP6.3(TAP)
NetDA10_6: DA10.6(OUT) R64.1 X70.1
NetDA11_1: DA11.1 R55.2
NetDA11_4: DA11.4 R66.1 VT6.1(G)
NetDA12_1: DA12.1 R67.2
NetDA12_3: DA12.3 R52.1
NetDA13_1: DA13.1(STAT) HL15.K
NetDA13_5: DA13.5(PROG) R69.2 R70.2
NetDD1_5: DD1.5(DCM) XP1.2
NetDD1_7: DD1.7(IUSB) XP3.2
NetDD1_8: DD1.8(~{DOK}) HL5.K X34.1
NetDD1_11: DD1.11(IDC) R28.2
NetDD1_13: DD1.13(ISET) RP4.1(TOP)
NetDD1_14: DD1.14(~{CEN}) XP5.2
NetDD1_15: DD1.15(USUS) XP2.2
NetDD1_16: DD1.16(THM) R19.1 R23.1 X19.1
NetDD1_18: DD1.18(~{FLT}) HL7.K X32.1
NetDD1_19: DD1.19(~{UOK}) HL6.K X33.1
NetDD1_22: DD1.22(~{CHG}) HL4.K X35.1
NetDD1_25: DD1.25(CS_1) DD1.26(CS_2) L1.1
NetDD2_3: DD2.3(SCL) R21.2 X17.1
NetDD2_4: DD2.4(SDA) R18.2 X16.1
NetDD2_5: DD2.5(CSN) R13.2 X18.1
NetDD2_8: DD2.8(ALRT) X15.1
NetDD2_9: DD2.9(THRM) R6.2
NetDD3_16: DD3.16(SCL) DD5.6(SCLK)
NetDD3_24: DD3.24(P8/P33) DD5.1(CS#)
NetDD3_25: DD3.25(P32) DD5.2(SO/SIO1)
NetDD4_1: DD4.1(SDO/SA0) X22.1
NetDD4_4: DD4.4(INT1) X24.1
NetDD4_9: DD4.9(INT2) X25.1
NetDD4_10: DD4.10(OCS_Aux) X27.1
NetDD4_11: DD4.11(SDO_Aux) X21.1
NetDD4_12: DD4.12(CS) X23.1
NetDD4_13: DD4.13(SCL) X26.1
NetDD4_14: DD4.14(SDA) X28.1
NetDD6_4: DD6.4(~{CTS!}) X43.1
NetDD6_16: DD6.16(~{RTS!}) X42.1
NetDD7_1: DD7.1(PA31/SWDIO/hs) XP11.9 XP16.1
NetDD7_3: DD7.3(PA01/XOUT32) XP18.1
NetDD7_4: DD7.4(PA02/AIN[0]/Vout) XP19.1
NetDD7_5: DD7.5(PA03/AIN[1]/VREFA) XP20.1
NetDD7_12: DD7.12(PA15/XOUT) XP36.1
NetDD7_13: DD7.13(PA16/hs/SER[0.0][1.0]SDA) XP32.1
NetDD7_14: DD7.14(PA17/hs/SER[0.1][1.1]SCL) XP31.1
NetDD7_22: DD7.22(VDDOUT) X44.1
NetDD7_24: DD7.24(PA30/SWCLK) XP11.7 XP12.1
NetDD8_1: DD8.1(SDO/SA0) R42.2
NetDD8_4: DD8.4(INT1) X45.1
NetDD8_9: DD8.9(INT2) X46.1
NetDD8_10: DD8.10(OCS_Aux) X47.1
NetDD8_11: DD8.11(SDO_Aux) X48.1
NetDD8_12: DD8.12(CS) R43.2
NetDD8_13: DD8.13(SCL) R44.2
NetDD8_14: DD8.14(SDA) R45.2
NetHL1_A: HL1.A R5.1
NetHL2_K: HL2.K R24.2
NetHL3_K: HL3.K R25.2
NetHL4_A: HL4.A R26.1
NetHL5_A: HL5.A R27.1
NetHL6_A: HL6.A R30.1
NetHL7_A: HL7.A R31.1
NetHL8_K: HL8.K R37.1
NetHL9_K: HL9.K R38.1
NetHL10_A: HL10.A R39.1
NetHL11_A: HL11.A R47.1
NetHL12_A: HL12.A R14.1
NetHL13_A: HL13.A R15.1
NetHL14_A: HL14.A R50.2
NetHL15_A: HL15.A R68.1
NetHL16_A: HL16.A R59.2
NetHL17_A: HL17.A R64.2
NetK1_1: K1.1 XT1.2
NetK1_2: K1.2 VD3.2(A) VT4.3(C)
NetK1_3: K1.3 XT1.3
NetK1_4: K1.4 XT1.1
NetR1_2: R1.2 XS3.3
NetR8_1: R8.1 R9.2 RP1.1(TOP) RP1.2(BOT)
NetR11_1: R11.1 R12.2 RP2.1(TOP) RP2.2(BOT)
NetR16_1: R16.1 SB2.1(COMMON)
NetR18_1: R18.1 R21.1 X14.1
NetR22_1: R22.1 XP9.3
NetR28_1: R28.1 RP3.1(TOP)
NetR29_2: R29.2 RP3.2(BOT) RP3.3(TAP)
NetR32_2: R32.2 RP4.2(BOT) RP4.3(TAP)
NetR52_2: R52.2 R53.2 VT4.1(B)
NetR54_1: R54.1 XT2.2
NetR55_1: R55.1 XT3.2
NetR56_1: R56.1 R57.1 VT3.1(B)
NetR56_2: R56.2 X68.1
NetR60_1: R60.1 R62.2 RP5.1(TOP) RP5.2(BOT)
NetR61_2: R61.2 R62.1
NetR67_1: R67.1 XT.2
NetR69_1: R69.1 XP10.1
NetR70_1: R70.1 XP41.1
NetTP1_1: TP1.1 XS1.4
NetVD4_2: VD4.2(A) VT5.3(D) XT4.2
NetVD5_1: VD5.1(C) VT6.3(D) XT5.1
NetX1_1: X1.1 XP4.1
NetX9_1: X9.1 XP4.3 XS1.1

Not connected (* = marked no-connect by the designer): DA1 4(NC)*; DA2 2(NC)*; DA5 4(NC)*; DD3 22(P2) 26(P25) 27(P24) 29(P13/P28) 30(P14/P38) 31(P15); DD5 3(WP#/SIO2)* 7(RESET#/SIO3)*; DD6 5(CBUS2)* 11(CBUS1)* 12(CBUS0)* 14(CBUS3)*; XP11 3* 4* 5; XS3 2 4; XS5 4

## Notes on the sheet
- DEVICE      INPUT POLARITY      RETRIGGER
  LTC6993-3   Falling-Edge                No
  LTC6993-3 will ignore additional trigger inputs until the
  output pulse has terminated.
- (near R64) The driving impedance (R1||R2) does not exceed 500kΩ
- R1
- R2
- (near X66) Supply Voltage (2.25V to 5.5V).
- от 50к до 800k
  RSET may range from 50k to 800k (equivalent to ISET
  between 1.25µA and 20µA).
- Интерфейс для програмирования Bluetooth.
- https://www.digikey.com/en/products/detail/epson/TSX-3225-24-0000MF15X-AC6/5261221
- https://www.digikey.com/en/products/detail/murata-electronics/XRCGB32M000F0L00R0/9959690
- Схема адаптера дебаггера
- sw1
- Резонаторы можно выбрать с параметрами.
  Crystal 24MHz 10ppM
  Crystal 32.768kHz 100ppM
- USB-UART Module. 3.3V levels
- RX
- TX
- 1k
- sb1
- Max. Operating Voltage (V) 3.60
  Min. Operating Voltage (V) 1.40
- (near WA1) Почитать <https://devzone.nordicsemi.com/f/nordic-q-a/64229/ble-beacon-2-4ghz-pcb-antenna-layout-for-soc-nordic-nrf52832>
- (near R10) Guide  EZ-BLE WICED Modules. page 40 <https://www.cypress.com/file/396961/download>
- (near DD3) SPI_MoSi/PUART_TX
- (near DD3) SPI_MiSo/PUART_RTS
- (near DD3) SPI_nCS_Blue/PUART_RX
- (near DD3) SPI_SCLK/PUART_CTS
- (near DA7) Заряд аккумулятора
- Ferrite Beads and Chips <https://www.digikey.com/en/products/filter/ferrite-beads-and-chips/841?s=N4IgjCBcpgbFoDGUBmBDANgZwKYBoQB7KAbRAGYBOMAVgA4QBdAgBwBcoQBlNgJwEsAdgHMQAXwJhKdSghDJI6bPiKkQABiasOkbnyGiJIAEzG6m6PNSZcBYpDKx16gAQB5ABYBbLC4ACLmDOALIAEgBeWiDsnADChACuLBg4ACYAqoL8bG4owThoWAm8OOIEALTGcgp8CSr2ZDRRMbriRvCW-Kmc5UEQ2pwgBACObACenP0g4yyluoXIYmJAA>
- SPI_MoSi
- SPI_MiSo
- SPI_SCLK
- (near DD5) SPI_nCS_Flash
- DC \ DC Converter  3.3V
- PSM=0-ON
- (near C39) Datasheet <https://www.macronix.com/Lists/Datasheet/Attachments/7425/MX25R4035F,%20Wide%20Range,%204Mb,%20v1.4.pdf>
- (near DA1) Datasheet <https://www.cypress.com/file/333436/download>
- (near DA1) Documentation <https://www.cypress.com/part/cyw20737a1kml2g>
- (near DA1) Printed Circuit Board Layout Guidelines <https://www.cypress.com/file/298151/download>
- Voltage - Supply
  1.65V  3.6V
- Input/output Voltage Range: 1.8V to 5.5V
- (near DA1) Crystal 24MHz 10ppM <https://www.digikey.com/en/products/filter/crystals/171?s=N4IgjCBcpgbFoDGUBmBDANgZwKYBoQB7KAbRACZyAOAZlgHYQC4rZYAWJ8WV2ATi4se5LuQAM5AKywIBSrTqjqNGoznKaA9bXYjtNaUtqStFZbDFG6es7Vg0rHR-AC6BAA4AXKCADKngCcASwA7AHMQAF8CfgQQZEh0bHwiUhB2MT5NBzcQLx9-YPCoggBaEWh4qECAVxTiSDJJEFz8yBAo6JBmyvcoMA8%2ByDAxMS74SqCAEx9Skdk873auAEdPAE8fBY33HB80LGRIyKA>
- (near DA1) Crystal 32.768kHz 100ppM <https://www.digikey.com/en/products/filter/crystals/171?s=N4IgjCBcpgbFoDGUBmBDANgZwKYBoQB7KAbRACZyAOAZlgHYQC4rZYAWJ8WV2ATi4se5LuQAM5AKywIBSrTqjqNGoznKaA9bXYjtNaUtqStFZbDFG6es7Vg0rHR-AC6BAA4AXKCADKngCcASwA7AHMQAF8CfgQQZEh0bHwiUhB2MT5NBzcQLx9-YPCoggBaEWh4qECAVxTiSDJJEFz8yBAo6JBmyvcoMA8%2ByDAxMS74SqCAEx9Skdk873auAEdPAE8fBY33HB80LGRIyKA>
- (near DA1) EZ-BLE™ WICED Module <https://www.digikey.com.au/htmldatasheets/production/2902866/0/0/1/CYBLE-013025-00-CYBLE-013030-00.pdf>
- CYBLE-013025-EVAL EZ-BLE™ Module Arduino Evaluation Board <https://www.cypress.com/documentation/development-kitsboards/cyble-013025-eval-ez-ble-module-arduino-evaluation-board>
- (near DA13) Заряд аккумулятора
- Модуль на этом блютузе. можно скопировать схему! <https://www.cypress.com/part/cyble-013025-00>
- (near XS4) Vbus: 3.9V to 14V
- Text <https://www.ti.com/lit/an/slva924/slva924.pdf?ts=1626947043192&ref_url=https%253A%252F%252Fwww.ti.com%252Fproduct%252FBQ25606>
- Text <https://www.ti.com/lit/df/tidrb87/tidrb87.pdf?ts=1627561585072&ref_url=https%253A%252F%252Fwww.ti.com%252Ftool%252FTIDA-00036>
- Text <https://www.ti.com/tool/BQ25606EVM-772#tech-docs>
- VSET. pull-down from VSET to GND.
  RPD > 50kΩ (float pin) = 4.208 V
  RPD < 500Ω (short to GND) = 4.352 V
  5kΩ < RPD < 25kΩ = 4.400 V
- (near C50) Cortex Debug Connector (10-pin)
  pitch 1.27mm
- Text <https://www.ti.com/lit/an/slva924/slva924.pdf?ts=1627408185864>
- VSET:
  Float: VREG = 4.208 V
  Short : VREG = 4.352 V
  RPD=10 Nü: VREG = 4.400 V
- Boost mode enable pin. When this pin is pulled HIGH, OTG is enabled. OTG cannot be floating.
- GND
- nSRST
- Программировать програматором Atmel ICE
- (near SB3) Корпус QFN24
- Atmel START <https://start.atmel.com/#dashboard>
- SYS
- SWO
- nc
- SWDCLK
- BAT
- VTG
- SWDIO
- (near C25) Vbus:
  Input 3.9 to 13.5V
- Термистор
- DAConlyPA02!
- Interrupt/pulldown
- PA04
- (near DD7) Gpio6 Interrupt only .PA00, PA01, PA04, PA05, PA14, PA15, PA18
- (near XP22) PA05
- Text <https://www.tindie.com/products/ceech/atmega32u4-board-w-nrf24l01-socket/>
- Text <https://www.distrelec.be/Web/Downloads/_t/ds/MIKROE-3348_eng_tds.pdf>
- Text <https://www.farnell.com/datasheets/2369936.pdf>
- cur limit for DC power input
  1 set by IDC
  0 500mA or 100mA
- 1 USB
  SUSPEND
  0 USB not SUSPEND
- 1 500mA
  0 100mA
- (near C9) 1 OFF
  0 CHARGE ON
- Single or dual power supply from 1.62V to 3.63V
- PA05
- TO SYSTEM
  LOAD
- FAULT OUTPUT
- USB PWR OK
- DC PWR OK
- (near DA4) Заряд аккумулятора
- CHARGE INDICATOR
- I charge
  =196ma.
- (near X35) Iset Fast-charge current programming resistor
  RISET = 600Ω      2000  mA
  RISET = 1.2kΩ     1000  mA
  RISET = 2.4kΩ     500    mA
  RISET Resistor Range  0.6- 2.4 kOhm.
  RISET = 1200V/ICHGMAX
- (near X12) ADAPTER
- (near X19) NTC
  10k
- (near R42) EN-active minimum Input Voltage =2V;
  Input Low Voltage Level=0.8V;
  Подобрать номиналы -
  EN - disable при уровне   1.9V
- DC Step-Down Output Current Limit (ISDLIM)
  RIDC = 3kΩ     2000   mA
  RIDC = 6kΩ     1000   mA
  RIDC = 12kΩ   500     mA
  RIDC = 6000V/IDC-MAX
  DC Step-Down Output CurrentLimit Step Range    0.5-2A
- (near X6) PK+
- +System
- SPI_nCS_IMU
- Protection
- (near R6) Optional 10k
- Optional 10k NTC Thermistor
- -System
- PK-
- (near C32) Documentation <https://www.cypress.com/part/cyw20737a1kml2g>
- Crystal 24MHz 10ppM <https://www.digikey.com/en/products/filter/crystals/171?s=N4IgjCBcpgbFoDGUBmBDANgZwKYBoQB7KAbRACZyAOAZlgHYQC4rZYAWJ8WV2ATi4se5LuQAM5AKywIBSrTqjqNGoznKaA9bXYjtNaUtqStFZbDFG6es7Vg0rHR-AC6BAA4AXKCADKngCcASwA7AHMQAF8CfgQQZEh0bHwiUhB2MT5NBzcQLx9-YPCoggBaEWh4qECAVxTiSDJJEFz8yBAo6JBmyvcoMA8%2ByDAxMS74SqCAEx9Skdk873auAEdPAE8fBY33HB80LGRIyKA>
- (in symbol 3220-10-0100-00 edge) Circuit
- (in symbol 1984620) Circuit
- (in symbol 10118193-0001LF) Circuit
- (in symbol 10118194-0001LF) Circuit
- (in symbol 0530480210) Circuit
- (in symbol 691137710002) Circuit
- (in symbol ATSAML10D16A-MUT) DIGITAL PIN; ANALOG PIN; OSCILLATORS; GROUND; INPUT SUPPLY; REGULATED INPUT/OUTPUT SUPPLY; RESET PIN; /hs-High Sink
- (in symbol LTC6993CS6-3#TRMPBF) in; out
- (in symbol MAX17047G+T10) GAS_GAUGE
- (in symbol MCP73832T-2DFI/OT) BatCharge
- (in symbol MIC5317-3.3YM5-TR) LDO 3.3V
- (in symbol MX25R4035FM1IL0) FLASH - NOR
- (in symbol PBS-7) Circuit
- (in symbol PLS-3) Circuit
- (in symbol TPS63031DSKT) DC-DC